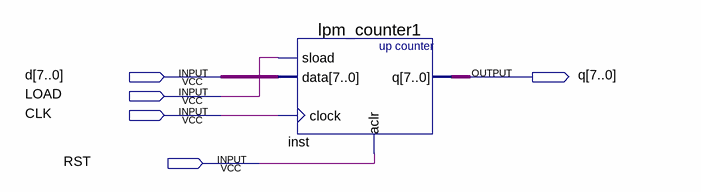
[diagram p0: schematic sheet]
// Quartus schematic counter.bdf as structural Verilog: 1 symbols, 5 pins
module counter (
  input  [7:0] d,
  input  LOAD,
  input  CLK,
  input  RST,
  output [7:0] q
);

  lpm_counter1 inst (.sload(LOAD), .data(d), .clock(CLK), .aclr(RST), .q(q));
endmodule
